# Altium schematic sheet LM76003.SchDoc
size 431 x 279 mm; Date: Not shown in title block; ApprovedBy: Not shown in title block; CheckedBy: Not shown in title block; Author: Not shown in title block; CompanyName: Not shown in title block; DrawnBy: Andy Lin (TI); Engineer: Not shown in title block; Organization: Not shown in title block; Address1: Not shown in title block; Address2: Not shown in title block; Address3: Not shown in title block; Address4: Not shown in title block; DocumentNumber: 6; Revision: Use project parameter SCH_Rev; SheetNumber: 6; SheetTotal: 14; PageSetup: Record=PageOptions|CenterHorizontal=True|CenterVertical=True|PrintScale=1.00|XCorrection=1.00|YCorrection=1.00|PrintKind=0|BorderSize=5000000|LeftOffset=0|BottomOffset=0|Orientation=2|PaperLength=1000|PaperWidth=1000|Scale=100|PaperSource=15|PrintQuality=600|MediaType=1|DitherType=10|PaperKind=Letter|PrintScaleMode=1; CurrentTime: Not shown in title block; CurrentDate: Not shown in title block; Time: Not shown in title block; DocumentFullPathAndName: Not shown in title block; DocumentName: Not shown in title block; ModifiedDate: Not shown in title block; ImagePath: Not shown in title block
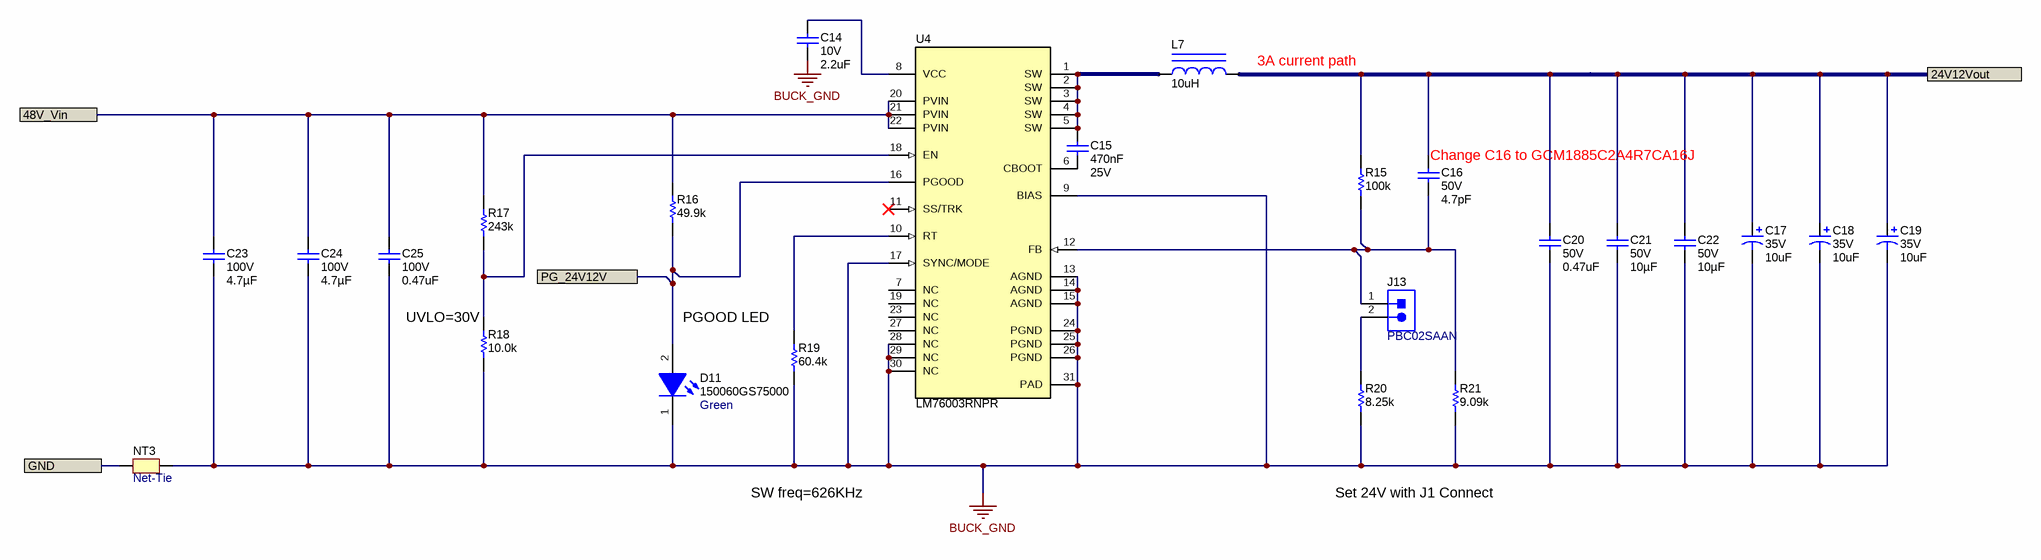
[diagram p0: LM76003.SchDoc]

## Parts
C14  VDC_V: 10V  ValueDisplayed: 2.2uF  [0603]  (hidden comment: GRM188R71A225KE15D)
C15  Cap_F: 470nF  VDC_V: 25V  [0603]  (hidden comment: GCM188R71E474KA64D)
C16  VDC_V: 50V  ValueDisplayed: 4.7pF  [0603]  (hidden comment: 06035A4R7CAT2A)
C17  VDC_V: 35V  ValueDisplayed: 10uF  [7343-31]  (hidden comment: 593D106X9035D2TE3)
C18  VDC_V: 35V  ValueDisplayed: 10uF  [7343-31]  (hidden comment: 593D106X9035D2TE3)
C19  VDC_V: 35V  ValueDisplayed: 10uF  [7343-31]  (hidden comment: 593D106X9035D2TE3)
C20  VDC_V: 50V  ValueDisplayed: 0.47uF  [0805_HV]  (hidden comment: GRM21BR71H474KA88L)
C21  VDC_V: 50V  ValueDisplayed: 10µF  [1210_280]  (hidden comment: GRJ32ER71H106KE11L)
C22  VDC_V: 50V  ValueDisplayed: 10µF  [1210_280]  (hidden comment: GRJ32ER71H106KE11L)
C23  VDC_V: 100V  ValueDisplayed: 4.7µF  [1210_220]  (hidden comment: GCM32DC72A475KE02L)
C24  VDC_V: 100V  ValueDisplayed: 4.7µF  [1210_220]  (hidden comment: GCM32DC72A475KE02L)
C25  VDC_V: 100V  ValueDisplayed: 0.47uF  [0805_HV]  (hidden comment: GRM21BR72A474KA73L)
D11  150060GS75000  value Green  [WL-SMCW_GREEN]
J13  PBC02SAAN  [Sullins_PBC02SAAN]
L7  ValueDisplayed: 10uH  [WE-LHMI_7030]  (hidden comment: 74437346100)
NT3  Net-Tie  [Net-Tie_50milWide_30milLong]  (net tie, no BOM)
R15  ValueDisplayed: 100k  [0402]  (hidden comment: CRCW0402100KFKED)
R16  ValueDisplayed: 49.9k  [0603]  (hidden comment: CRCW060349K9FKEA)
R17  ValueDisplayed: 243k  [0402]  (hidden comment: CRCW0402243KFKED)
R18  ValueDisplayed: 10.0k  [0402]  (hidden comment: CRCW040210K0FKED)
R19  ValueDisplayed: 60.4k  [0402]  (hidden comment: CRCW040260K4FKED)
R20  ValueDisplayed: 8.25k  [0402]  (hidden comment: CRCW04028K25FKED)
R21  ValueDisplayed: 9.09k  [0402]  (hidden comment: CRCW04029K09FKED)
U4  LM76003RNPR  [RNP0030B]

## Ports
24V12Vout, 48V_Vin, GND, PG_24V12V

## Nets
BUCK_GND: C14.2 C17.2(-) C18.2(-) C19.2(-) C20.2 C21.2 C22.2 C23.2 C24.2 C25.2 D11.1(K) NT3.2 R18.1 R19.1 R20.1 R21.1 U4.9(BIAS) U4.13(AGND) U4.14(AGND) U4.15(AGND) U4.17(SYNC/MODE) U4.24(PGND) U4.25(PGND) U4.26(PGND) U4.28(NC) U4.29(NC) U4.30(NC) U4.31(PAD)
24V12Vout: C16.1 C17.1(+) C18.1(+) C19.1(+) C20.1 C21.1 C22.1 L7.2 R15.2 ; port 24V12Vout
48V_Vin: C23.1 C24.1 C25.1 R16.2 R17.2 U4.20(PVIN) U4.21(PVIN) U4.22(PVIN) ; port 48V_Vin
GND: NT3.1 ; port GND
PG_24V12V: D11.2(A) R16.1 U4.16(PGOOD) ; port PG_24V12V
NetC14_1: C14.1 U4.8(VCC)
NetC15_1: C15.1 L7.1 U4.1(SW) U4.2(SW) U4.3(SW) U4.4(SW) U4.5(SW)
NetC15_2: C15.2 U4.6(CBOOT)
NetC16_2: C16.2 J13.1 R15.1 R21.2 U4.12(FB)
NetJ13_2: J13.2 R20.2
NetR17_1: R17.1 R18.2 U4.18(EN)
NetR19_2: R19.2 U4.10(RT)

Not connected (* = marked no-connect by the designer): U4 7(NC) 11(SS/TRK)* 19(NC) 23(NC) 27(NC)

## Notes on the sheet
- (near L7) 3A current path
- (near C16) Change C16 to GCM1885C2A4R7CA16J
- (near R18) UVLO=30V
- PGOOD LED
- SW freq=626KHz
- Set 24V with J1 Connect
- Drawn By:
- SVN Rev:
- Number:
- TID #:
- Orderable:
- Rev:
- Sheet Title:
- File:
- Project Title:
- Designed for:
- Assembly Variant:
- Mod. Date:
- Sheet:
- Size:
- of
- B
- http://www.ti.com
- Texas Instruments and/or its licensors do not warrant the accuracy or completeness of this specification or any information contained therein. Texas Instruments and/or its licensors do not warrant that this design will meet the specifications, will be suitable for your application or fit for any particular purpose, or will operate in an implementation. Texas Instruments and/or its licensors do not warrant that the design is production worthy. You should completely validate and test your design implementation to confirm the system functionality for your application.
- Engineer:
- Contact:
- © Texas Instruments

## Library data of the parts
C14 = CMP-0007370-4: CAP, CERM, 2.2 uF, 10 V, +/- 10%, X7R, 0603; Manufacturer: MuRata; TaMin_C: -55°C; ESR_ohm: 9m; Polarized: N; SizeAreaWB_mm2: 4.68; Value1: 0.009 ohm; U/M: EA; Value: 2.2uF; TaMax_C: 125°C; SizeZ_mm: 1; SizeX_mm: 1.6; SizeY_mm: 0.8; SizeArea_mm2: 1.28; Cap_F: 2.2µF; AEC Category: Q200; Supplier Part Number 2: 81-GRM188R71A225KE15; Publisher: Texas Instruments; Supplier 2: Mouser; Supplier Part Number 3: 1797012; TempCo: X7R; Supplier 3: Farnell; Published: 2008-06-19; RoHS: Y; MountType: SMT; Supplier 1: Digi-Key; PackageReference: 0603; Tolerance_%: 10%; Cap_Case: 0603; Value2: 10V; CompType: Capacitor; LatestRevisionDate: 2017-03-09; PartNumber: GRM188R71A225KE15D; AEC Qualified: ?; ComponentLink1Description: Datasheet link; Supplier Part Number 1: 490-4520-1-ND; Technology: Ceramic; ComponentLink1URL: http://search.murata.co.jp/Ceramy/PnsearchViewAction.do?HnOFG=ON&HnNFG=ON&SEL_CNT=50&sLang=en&sKey=GRM188R71A225KE15D&x=9&y=9&search=startwith
C15 = CMP-0007142-4: CAP, CERM, 0.47 uF, 25 V, +/- 10%, X7R, AEC-Q200 Grade 1, 0603; Manufacturer: MuRata; TaMin_C: -55°C; Polarized: N; SizeAreaWB_mm2: 4.68; Value1: Unknown; U/M: EA; Value: 0.47uF; TaMax_C: 125°C; SizeZ_mm: 1; SizeX_mm: 1.6; SizeY_mm: 0.8; SizeArea_mm2: 1.28; AEC Qualified: Y; AEC Category: Q200; Supplier Part Number 2: 81-GCM188R71E474KA4D; Publisher: Texas Instruments; Supplier 2: Mouser; TempCo: X7R; Published: 2008-06-19; RoHS: Y; MountType: SMT; Supplier 1: Digi-Key; PackageReference: 0603; Tolerance_%: 10%; Cap_Case: 0603; Value2: 25V; CompType: Capacitor; LatestRevisionDate: 2017-03-09; PartNumber: GCM188R71E474KA64D; ComponentLink1Description: Datasheet link; AEC Grade: 1; Supplier Part Number 1: 490-4776-1-ND; Technology: Ceramic; ValueDisplayed: 0.47uF; ComponentLink1URL: http://psearch.murata.com/capacitor/product/GCM188R71E474KA64%23.pdf
C16 = CMP-0006791-4: CAP, CERM, 4.7 pF, 50 V, +/- 5%, C0G/NP0, 0603; Manufacturer: AVX; TaMin_C: -55°C; ESR_ohm: 0.633; Polarized: N; SizeAreaWB_mm2: 4.68; Value1: 0.633 ohm; U/M: EA; Value: 4.7pF; TaMax_C: 125°C; SizeZ_mm: 1; SizeX_mm: 1.6; SizeY_mm: 0.8; SizeArea_mm2: 1.28; AEC Category: Q200; Supplier Part Number 2: 581-06035A4R7C; Publisher: Texas Instruments; Supplier 2: Mouser; Supplier Part Number 3: 1833866; TempCo: C0G/NP0; Supplier 3: Farnell; Published: 2008-06-19; RoHS: Y; MountType: SMT; Supplier 1: Digi-Key; PackageReference: 0603; Tolerance_%: 5%; Cap_Case: 0603; Value2: 50V; CompType: Capacitor; LatestRevisionDate: 2017-03-09; PartNumber: 06035A4R7CAT2A; AEC Qualified: N; Cap_F: 4.7pF; ComponentLink1Description: Datasheet link; AEC Grade: N/A; Supplier Part Number 1: 478-1159-1-ND; Technology: Ceramic; ComponentLink1URL: http://datasheets.avx.com/C0GNP0-Dielectric.pdf
C17 = CMP-0011718-2: CAP, TA, 10 uF, 35 V, +/- 10%, 0.3 ohm, SMD; Manufacturer: Vishay-Sprague; TaMin_C: -55°C; ESR_ohm: 0.3; Polarized: Y; SizeAreaWB_mm2: 58.59; Value1: 0.3 ohm; U/M: EA; Value: 10uF; TaMax_C: 125°C; SizeZ_mm: 3.1; SizeX_mm: 7.3; SizeY_mm: 4.3; Cap_Case: D; SizeArea_mm2: 31.39; CompType: Capacitor; Cap_F: 10µF; IRMS_A: 710mA; AEC Category: Q200; ComponentLink1URL: http://www.vishay.com/docs/40005/593d.pdf; Supplier Part Number 2: 65K2991; Publisher: Texas Instruments; Supplier 2: Newark; Supplier Part Number 3: 74-593D106X9035D2TE3; Supplier 3: Mouser; RoHS: Y; MountType: SMT; Supplier 1: Digi-Key; LatestRevisionNote: Updated supplier links; PackageReference: 7343-31; Tolerance_%: 10%; Value2: 35V; LatestRevisionDate: 2017-03-09; PartNumber: 593D106X9035D2TE3; AEC Qualified: ?; Series: 593D; ComponentLink1Description: Datasheet link; Supplier Part Number 1: 718-1099-1-ND; Technology: TA
C18 C19 = CMP-0011718-1: CAP, TA, 10 uF, 35 V, +/- 10%, 0.3 ohm, SMD; Manufacturer: Vishay-Sprague; TaMin_C: -55°C; ESR_ohm: 0.3; Polarized: Y; SizeAreaWB_mm2: 58.59; Value1: 0.3 ohm; U/M: EA; Value: 10uF; TaMax_C: 125°C; SizeZ_mm: 3.1; SizeX_mm: 7.3; SizeY_mm: 4.3; Cap_Case: D; SizeArea_mm2: 31.39; CompType: Capacitor; Cap_F: 10µF; IRMS_A: 710mA; AEC Category: Q200; ComponentLink1URL: http://www.vishay.com/docs/40005/593d.pdf; Supplier Part Number 2: 65K2991; Publisher: Texas Instruments; Supplier 2: Newark; Supplier Part Number 3: 74-593D106X9035D2TE3; Supplier 3: Mouser; RoHS: Y; MountType: SMT; Supplier 1: Digi-Key; LatestRevisionNote: Updated supplier links; PackageReference: 7343-31; Tolerance_%: 10%; Value2: 35V; LatestRevisionDate: 2017-03-09; PartNumber: 593D106X9035D2TE3; AEC Qualified: ?; Series: 593D; ComponentLink1Description: Datasheet link; Supplier Part Number 1: 718-1099-1-ND; Technology: TA
C20 = CMP-0008357-1: CAP, CERM, 0.47 uF, 50 V, +/- 10%, X7R, 0805; Manufacturer: MuRata; TaMin_C: -55°C; Polarized: N; SizeAreaWB_mm2: 6.75; Value1: Unknown; U/M: EA; Value: 0.47uF; TaMax_C: 125°C; SizeZ_mm: 1.45; SizeX_mm: 2; SizeY_mm: 1.25; Cap_Case: 0805; SizeArea_mm2: 2.5; Cap_F: 470nF; AEC Category: Q200; ComponentLink1URL: http://search.murata.co.jp/Ceramy/PnsearchViewAction.do?HnOFG=ON&HnNFG=ON&SEL_CNT=50&sLang=en&sKey=GRM21BR71H474KA88L&x=9&y=9&search=startwith; Supplier Part Number 2: 81-GRM21BR71H474KA88; Publisher: Texas Instruments; Supplier 2: Mouser; Supplier Part Number 3: 1403966; TempCo: X7R; Supplier 3: Farnell; Published: 2008-06-19; RoHS: Y; MountType: SMT; Supplier 1: Digi-Key; PackageReference: 0805; Tolerance_%: 10%; Value2: 50V; CompType: Capacitor; LatestRevisionDate: 2017-03-09; PartNumber: GRM21BR71H474KA88L; AEC Qualified: ?; ComponentLink1Description: Datasheet link; Supplier Part Number 1: 490-3328-1-ND; Technology: Ceramic
C21 C22 = CMP-0081135-1: CAP, CERM, 10 µF, 50 V,+/- 10%, X7R, 1210; Manufacturer: MuRata; TaMin_C: -55°C; ESR_ohm: 1m; Polarized: N; SizeAreaWB_mm2: 14.7; Value1: 0.001 ohm; U/M: EA; Value: 10uF; TaMax_C: 125°C; SizeZ_mm: 2.8; SizeX_mm: 3.2; SizeY_mm: 2.5; Cap_Case: 1210; SizeArea_mm2: 8; AEC Category: Q200; ComponentLink1URL: https://search.murata.co.jp/Ceramy/image/img/A01X/G101/ENG/GRJ32ER71H106KE11-01.pdf; Supplier Part Number 2: 81-GRJ32ER71H106KE1L; Supplier 2: Mouser; TempCo: X7R; RoHS: Y; MountType: SMT; Supplier 1: Digi-Key; PackageReference: 1210; Tolerance_%: 10%; Value2: 50V; CompType: Capacitor; PartNumber: GRJ32ER71H106KE11L; AEC Qualified: N; Cap_F: 10µF; ComponentLink1Description: Datasheet link; AEC Grade: N/A; Supplier Part Number 1: 490-10961-1-ND; Technology: Ceramic
C23 C24 = CMP-0082268-1: CAP, CERM, 4.7 µF, 100 V,+/- 10%, X7S, AEC-Q200 Grade 1, 1210; Manufacturer: MuRata; TaMin_C: -55°C; ESR_ohm: 1m; Polarized: N; SizeAreaWB_mm2: 14.7; Value1: 0.001 ohm; U/M: EA; Value: 4.7uF; TaMax_C: 125°C; SizeZ_mm: 2.2; SizeX_mm: 3.2; SizeY_mm: 2.5; Cap_Case: 1210; SizeArea_mm2: 8; AEC Qualified: Y; IRMS_A: 6A; AEC Grade: 1; AEC Category: Q200; ComponentLink1URL: https://search.murata.co.jp/Ceramy/image/img/A01X/G101/ENG/GCM32DC72A475KE02-01.pdf; Supplier Part Number 2: 81-GCM32DC72A475KE2L; Supplier 2: Mouser; TempCo: X7S; RoHS: Y; MountType: SMT; Supplier 1: Digi-Key; PackageReference: 1210; Tolerance_%: 10%; Value2: 100V; CompType: Capacitor; PartNumber: GCM32DC72A475KE02L; Cap_F: 4.7µF; ComponentLink1Description: Datasheet link; Supplier Part Number 1: 490-14484-1-ND; Technology: Ceramic
C25 = CMP-0008374-2: CAP, CERM, 0.47 uF, 100 V, +/- 10%, X7R, 0805; Manufacturer: MuRata; TaMin_C: -55°C; Polarized: N; SizeAreaWB_mm2: 6.75; Value1: Unknown; U/M: EA; Value: 0.47uF; TaMax_C: 125°C; SizeZ_mm: 1.45; SizeX_mm: 2; SizeY_mm: 1.25; Cap_Case: 0805; SizeArea_mm2: 2.5; Cap_F: 470nF; AEC Category: Q200; Supplier Part Number 2: 81-GRM21BR72A474KA73; Publisher: Texas Instruments; Supplier 2: Mouser; TempCo: X7R; Published: 2008-06-19; RoHS: Y; MountType: SMT; Supplier 1: Digi-Key; PackageReference: 0805; Tolerance_%: 10%; Value2: 100V; CompType: Capacitor; LatestRevisionDate: 2017-03-09; PartNumber: GRM21BR72A474KA73L; AEC Qualified: ?; ComponentLink1Description: Datasheet link; Supplier Part Number 1: 490-3326-1-ND; Technology: Ceramic; ComponentLink1URL: http://search.murata.co.jp/Ceramy/PnsearchViewAction.do?HnOFG=ON&HnNFG=ON&SEL_CNT=50&sLang=en&sKey=GRM21BR72A474KA73L&x=9&y=9&search=startwith
D11 = CMP-0002905-2: LED, Green, SMD; Manufacturer: Wurth Elektronik; Value1: W; Type: InGaN; Value2: 3.2V; Io_A: 20mA; Angle: 140; Tjmax_C: 85°C; Color: Green; Vf_V: 3.2V; PartNumber: 150060GS75000; ComponentLink1Description: Datasheet link; ComponentLink1URL: http://katalog.we-online.de/led/datasheet/150060GS75000.pdf; MountType: SMT; PackageReference: LED_0603; CompType: LED; RoHS: Y
J13 = CMP-0054566-1: Header, 100mil, 2x1, Gold, TH; Manufacturer: Sullins Connector Solutions; CNHeader: TRUE; Current_A: 3A; Green_Lifecycle: Active; Shrouded: N; Gender: Male; Green_REACh: Passed; Voltage_V: 1.8kV; Row_Count: 1; Pitch_mm: 2.54; CT: FALSE; Cert_UL: Y; ComponentLink1URL: http://www.sullinscorp.com/catalogs/77_PAGE108-109_.100_MALE_HDR.pdf; ClassName: Header; Publisher: Texas Instruments; Color: Black; RoHS: Y; MountType: TH; Green_EU RoHS-2: Passed; Supplier 1: Digi-Key; Green_EU RoHS: Passed; PackageReference: Sullins 100mil, 1x2, 230 mil above insulator; PinCount: 2; CompType: Header; LatestRevisionDate: 26/05/2017; PartNumber: PBC02SAAN; Orientation: Vertical; ComponentLink1Description: Datasheet URL; Supplier Part Number 1: S1011E-02-ND; ContactFinish: Gold
L7 = CMP-0064098-1: Inductor, Shielded Drum Core, Powdered Iron, 10 uH, 3 A, 0.075 ohm, SMD; Manufacturer: Wurth Elektronik; Isat: 7.3A @ 20% inductance drop; Irms: 3A @ 40C rise; Green_Lifecycle: Active; SizeAreaWB_mm2: 73.96; DCR_ohm: 0.075; Green_REACh: Passed; Value: 10uH; Imax_A: 3A; SizeZ_mm: 3; SizeX_mm: 6.6; SizeArea_mm2: 43.56; Ind_H: 10µH; AEC Qualified: N; AEC Category: Q200; ComponentLink1URL: http://katalog.we-online.de/kataloge/eisos/media/pdf/74437346100.pdf; Publisher: Texas Instruments; Published: 2008-06-26; RoHS: Y; Value1: 0.075 ohm; Material: Powdered Iron; MountType: SMT; Green_EU RoHS-2: Incomplete; Supplier 1: Digi-Key; Green_EU RoHS: Passed; PackageReference: 7.30x2.80x6.60mm; SizeY_mm: 6.6; Value2: 3A; CompType: Inductor; LatestRevisionDate: 2017-06-02; PartNumber: 74437346100; ComponentLink1Description: Datasheet link; AEC Grade: N/A; Supplier Part Number 1: 732-3379-1-ND; Technology: Shielded Drum Core
NT3 = CMP-0078142-2: Single point connection between nets.; CompType: Net-Tie; PackageReference: N/A; Library Reference: Net-Tie; Manufacturer: N/A; PartNumber: N/A; MountType: SMT
R15 = CMP-0025950-3: RES, 100 k, 1%, 0.063 W, AEC-Q200 Grade 0, 0402; Manufacturer: Vishay-Dale; Power_W: 63mW; TempCo: 100 ppm/C; Value: 100k; EIA_Code: E96; SizeX_mm: 1; SizeY_mm: 0.5; SizeZ_mm: 0.6; Value2: 0.063W; AEC Qualified: Y; VDC_V: 50V; AEC Category: Q200; AEC Grade: 0; Supplier Part Number 2: 52K6607; Supplier 2: Newark; Supplier Part Number 3: 71-CRCW0402-100K-E3; Supplier 3: Mouser; Value_Code: 100k; RoHS: E; Value1: 1%; MountType: SMT; Supplier 1: Digi-Key; PackageReference: 0402; Tolerance_%: 1%; Res_ohm: 100k; SizeArea_mm2: 0.5; CompType: Resistor; PartNumber: CRCW0402100KFKED; ComponentLink1Description: Datasheet link; Supplier Part Number 1: 541-100KLCT-ND; Technology: Thick Film; ComponentLink1URL: http://www.vishay.com/docs/20035/dcrcwe3.pdf
R16 = CMP-0022447-1: RES, 49.9 k, 1%, 0.1 W, 0603; Manufacturer: Vishay-Dale; Power_W: 100mW; TempCo: 100 ppm/C; Value_Code: 49k9; U/M: EA; Value: 49.9k; EIA_Code: E96; SizeX_mm: 1.6; SizeY_mm: 0.8; SizeZ_mm: 1; Value2: 0.1W; SizeArea_mm2: 1.28; VDC_V: 75V; AEC Category: Q200; ComponentLink1URL: http://www.vishay.com/docs/20035/dcrcwe3.pdf; Supplier Part Number 2: 71-CRCW0603-49.9K-E3; Publisher: Texas Instruments; Supplier 2: Mouser; Supplier Part Number 3: 1652882; Supplier 3: Farnell; Published: 2008-06-26; RoHS: Y; Value1: 1%; MountType: SMT; Supplier 1: Digi-Key; PackageReference: 0603; Tolerance_%: 1%; Res_ohm: 49.9k; CompType: Resistor; LatestRevisionDate: 2017-03-09; PartNumber: CRCW060349K9FKEA; AEC Qualified: ?; ComponentLink1Description: Datasheet link; Supplier Part Number 1: 541-49.9KHCT-ND; Technology: Thick Film
R17 = CMP-0026191-2: RES, 243 k, 1%, 0.063 W, AEC-Q200 Grade 0, 0402; Manufacturer: Vishay-Dale; Power_W: 63mW; TempCo: 100 ppm/C; Value: 243k; EIA_Code: E96; SizeX_mm: 1; SizeY_mm: 0.5; SizeZ_mm: 0.6; Value2: 0.063W; AEC Qualified: Y; VDC_V: 50V; AEC Category: Q200; AEC Grade: 0; ComponentLink1URL: http://www.vishay.com/docs/20035/dcrcwe3.pdf; Supplier Part Number 2: 52K6881; Supplier 2: Newark; Supplier Part Number 3: 71-CRCW0402-243K-E3; Supplier 3: Mouser; Value_Code: 243k; RoHS: E; Value1: 1%; MountType: SMT; Supplier 1: Digi-Key; PackageReference: 0402; Tolerance_%: 1%; Res_ohm: 243k; SizeArea_mm2: 0.5; CompType: Resistor; PartNumber: CRCW0402243KFKED; ComponentLink1Description: Datasheet link; Supplier Part Number 1: 541-243KLCT-ND; Technology: Thick Film
R18 = CMP-0025958-3: RES, 10.0 k, 1%, 0.063 W, AEC-Q200 Grade 0, 0402; Manufacturer: Vishay-Dale; Power_W: 63mW; TempCo: 100 ppm/C; Value_Code: 10k0; Value: 10.0k; EIA_Code: E96; Res_ohm: 10k; SizeX_mm: 1; SizeY_mm: 0.5; SizeZ_mm: 0.6; Value2: 0.063W; AEC Qualified: Y; VDC_V: 50V; AEC Category: Q200; AEC Grade: 0; Supplier Part Number 2: 52K6595; Supplier 2: Newark; Supplier Part Number 3: 71-CRCW0402-10K-E3; Supplier 3: Mouser; RoHS: E; Value1: 1%; MountType: SMT; Supplier 1: Digi-Key; PackageReference: 0402; Tolerance_%: 1%; SizeArea_mm2: 0.5; CompType: Resistor; PartNumber: CRCW040210K0FKED; ComponentLink1Description: Datasheet link; Supplier Part Number 1: 541-10.0KLCT-ND; Technology: Thick Film; ComponentLink1URL: http://www.vishay.com/docs/20035/dcrcwe3.pdf
R19 = CMP-0026486-2: RES, 60.4 k, 1%, 0.063 W, AEC-Q200 Grade 0, 0402; Manufacturer: Vishay-Dale; Power_W: 63mW; TempCo: 100 ppm/C; Value_Code: 60k4; Value: 60.4k; EIA_Code: E96; SizeX_mm: 1; SizeY_mm: 0.5; SizeZ_mm: 0.6; Value2: 0.063W; AEC Qualified: Y; VDC_V: 50V; AEC Category: Q200; AEC Grade: 0; ComponentLink1URL: http://www.vishay.com/docs/20035/dcrcwe3.pdf; Supplier Part Number 2: 52K7190; Supplier 2: Newark; Supplier Part Number 3: 71-CRCW0402-60.4K-E3; Supplier 3: Mouser; RoHS: E; Value1: 1%; MountType: SMT; Supplier 1: Digi-Key; PackageReference: 0402; Tolerance_%: 1%; Res_ohm: 60.4k; SizeArea_mm2: 0.5; CompType: Resistor; PartNumber: CRCW040260K4FKED; ComponentLink1Description: Datasheet link; Supplier Part Number 1: 541-60.4KLCT-ND; Technology: Thick Film
R20 = CMP-0026589-2: RES, 8.25 k, 1%, 0.063 W, AEC-Q200 Grade 0, 0402; Manufacturer: Vishay-Dale; Power_W: 63mW; TempCo: 100 ppm/C; Value_Code: 8k25; Value: 8.25k; EIA_Code: E96; SizeX_mm: 1; SizeY_mm: 0.5; SizeZ_mm: 0.6; Value2: 0.063W; AEC Qualified: Y; VDC_V: 50V; AEC Category: Q200; AEC Grade: 0; ComponentLink1URL: http://www.vishay.com/docs/20035/dcrcwe3.pdf; Supplier Part Number 2: 52K7288; Supplier 2: Newark; Supplier Part Number 3: 71-CRCW0402-8.25K-E3; Supplier 3: Mouser; RoHS: E; Value1: 1%; MountType: SMT; Supplier 1: Digi-Key; PackageReference: 0402; Tolerance_%: 1%; Res_ohm: 8.25k; SizeArea_mm2: 0.5; CompType: Resistor; PartNumber: CRCW04028K25FKED; ComponentLink1Description: Datasheet link; Supplier Part Number 1: 541-8.25KLCT-ND; Technology: Thick Film
R21 = CMP-0026619-3: RES, 9.09 k, 1%, 0.063 W, AEC-Q200 Grade 0, 0402; Manufacturer: Vishay-Dale; VDC_V: 50V; Value2: 0.063W; Power_W: 63mW; AEC Qualified: Y; SizeZ_mm: 0.6; TempCo: 100 ppm/C; SizeArea_mm2: 0.5; SizeX_mm: 1; Value: 9.09k; Value_Code: 9k09; AEC Category: Q200; AEC Grade: 0; EIA_Code: E96; PartNumber: CRCW04029K09FKED; Supplier Part Number 3: 71-CRCW0402-9.09K-E3; Supplier 1: Digi-Key; CompType: Resistor; Supplier Part Number 1: 541-9.09KLCT-ND; Supplier 2: Newark; SizeY_mm: 0.5; Value1: 1%; ComponentLink1Description: Datasheet link; Res_ohm: 9.09k; ComponentLink1URL: http://www.vishay.com/docs/20035/dcrcwe3.pdf; Technology: Thick Film; MountType: SMT; Supplier Part Number 2: 52K7332; PackageReference: 0402; Supplier 3: Mouser; Tolerance_%: 1%; RoHS: E
U4 = CMP-0013938-2: SIMPLE SWITCHER 3.5V to 60V 3.5A Synchronous Step-Down Voltage Regulator, RNP0030B (WQFN-30); Manufacturer: Texas Instruments; Alternate PartNumber: LM76003RNPT; SizeX_mm: 4; SizeY_mm: 6; CompType: IC; SizeZ_mm: 0.8; SizeArea_mm2: 24; SizeAreaWB_mm2: 48; U/M: EA; PackageDescription: WQFN-30; PartNumber: LM76003RNPR; ComponentLink1URL: https://sps06.itg.ti.com/sites/KMS/crossdivteams/altium/docs/ComponentDatasheets/LM76003_prelimDS_Jan 26 2017.docx; ComponentLink1Description: Datasheet Link; LatestRevisionDate: 2017-03-09; Publisher: Texas Instruments; PackageReference: RNP0030B; MountType: SMT; Alternate Manufacturer: Texas Instruments